# Altium schematic sheet Sheet2.SchDoc
size 420 x 297 mm; CheckedBy: Ravindu Tennakoon; DrawnBy: Senuda Ratnayake; SheetNumber: 1; SheetTotal: 1
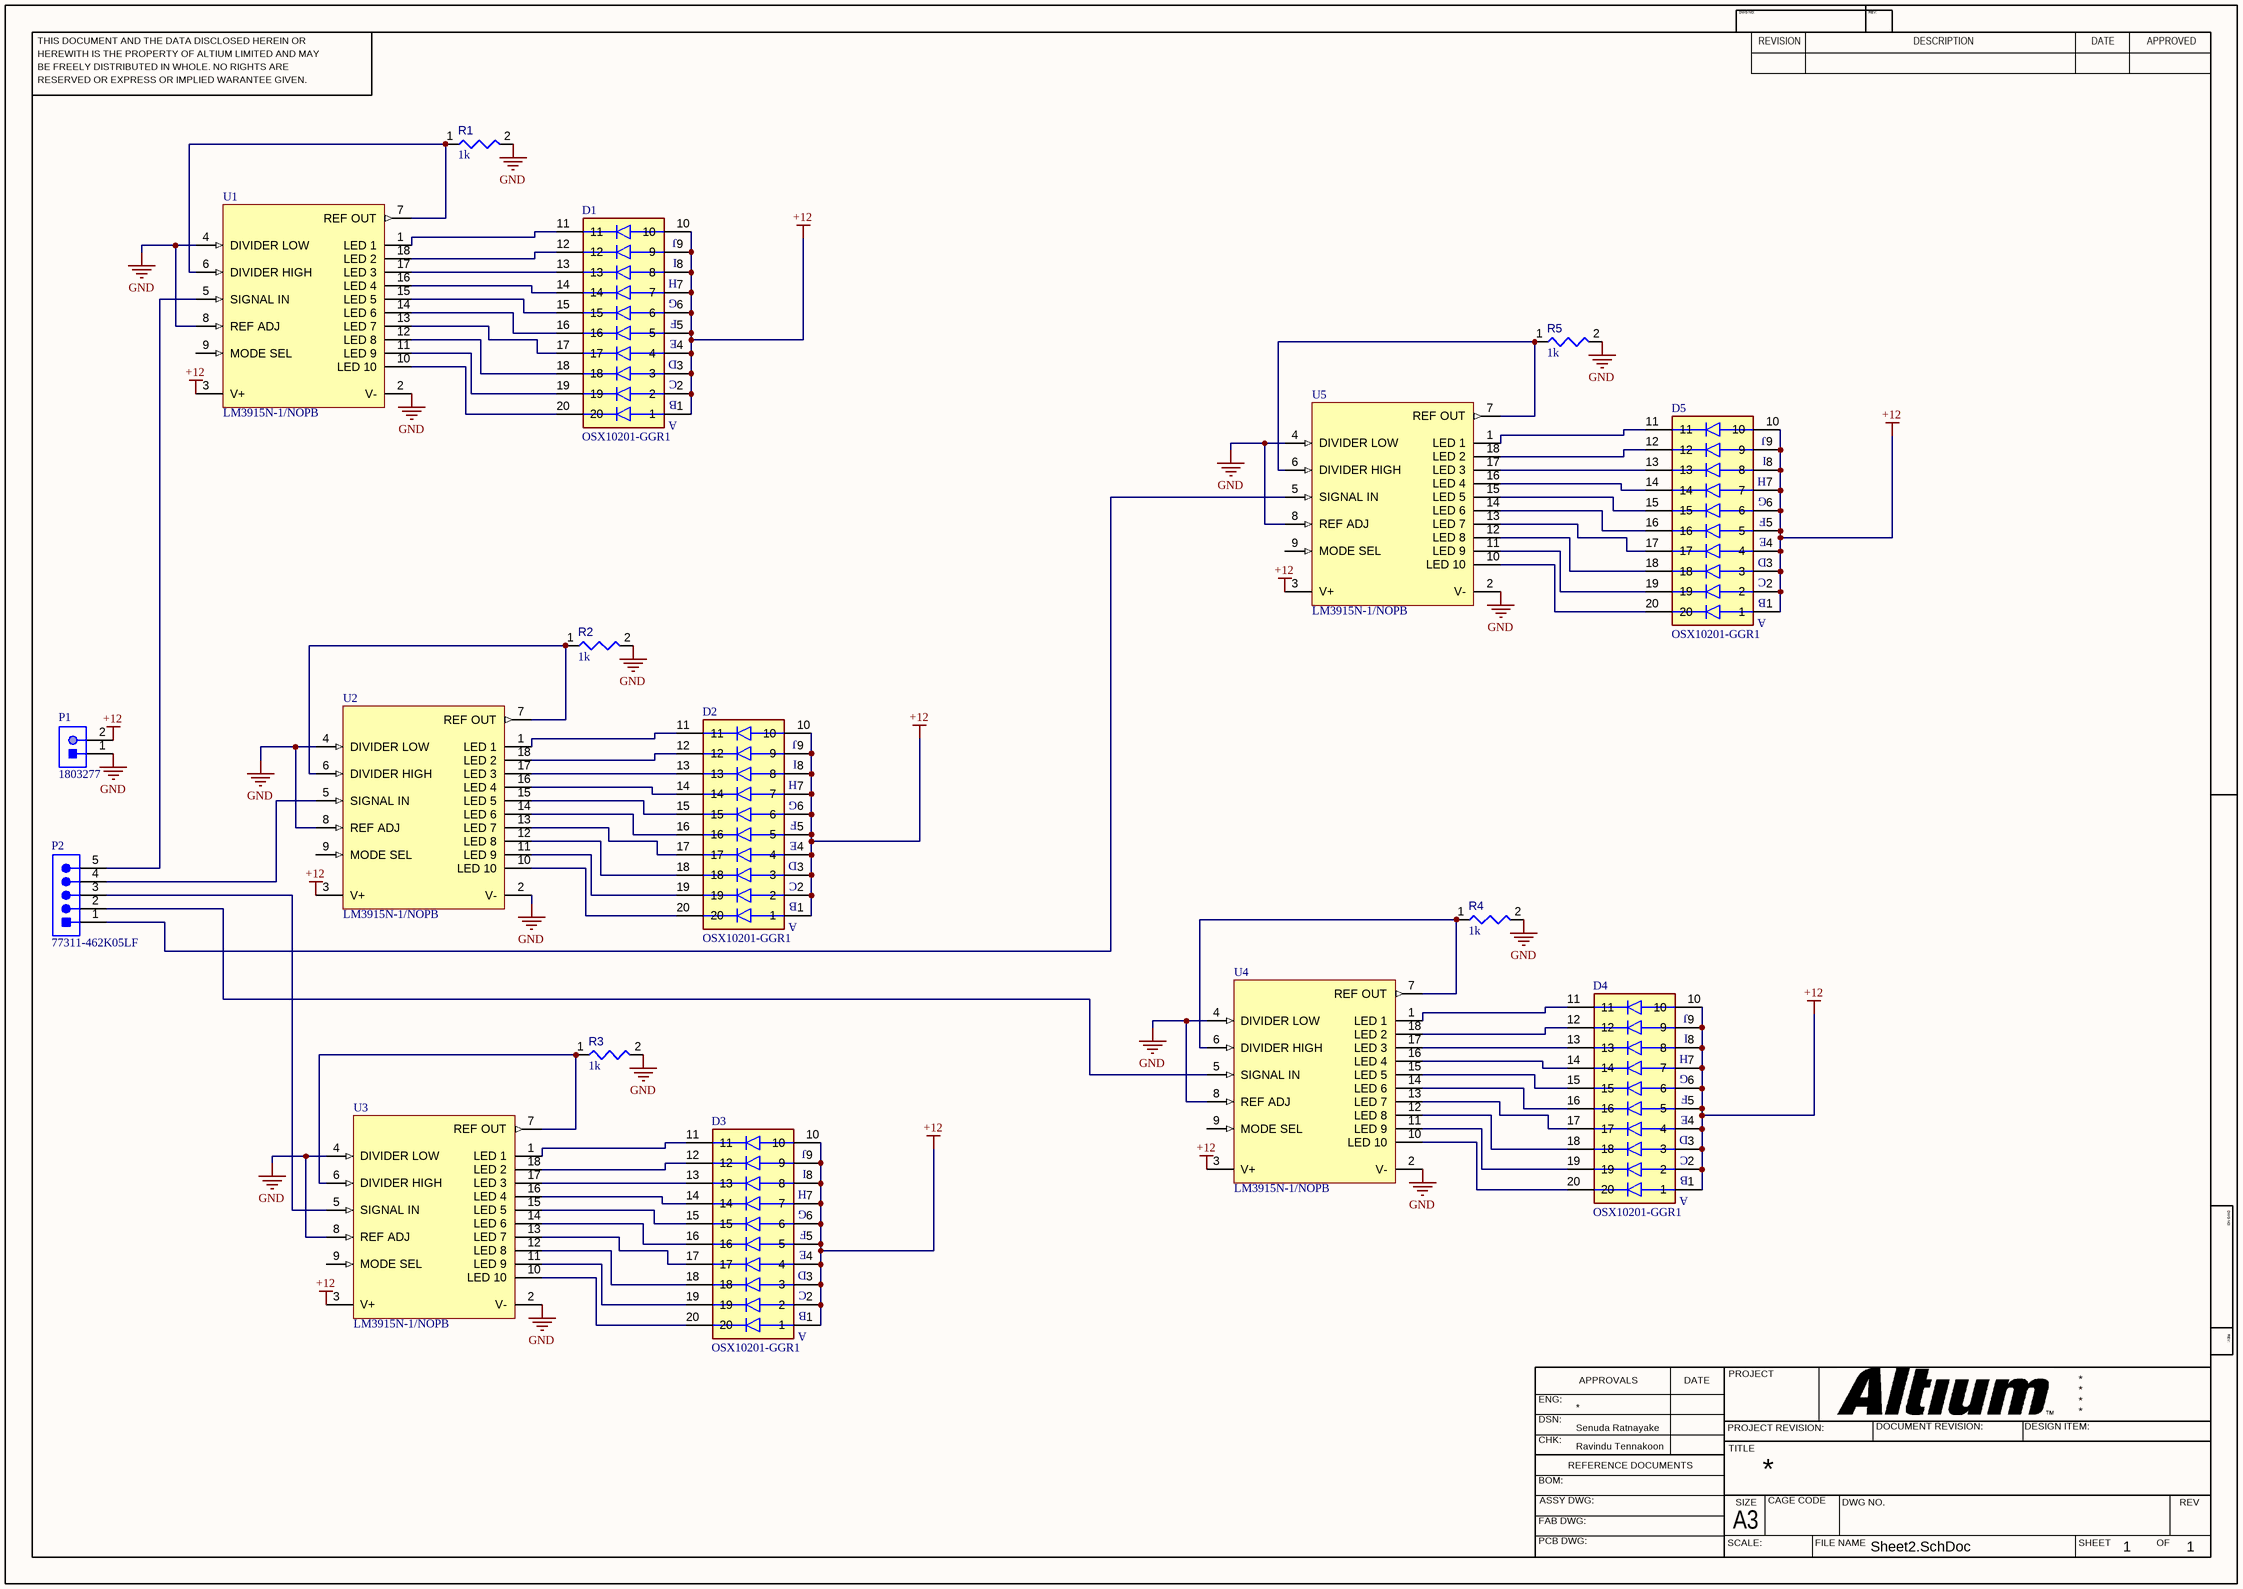
[diagram p0: Sheet2.SchDoc]

## Parts
D1  OSX10201-GGR1  [DIP760W45P254L2550H790Q20]
D2  OSX10201-GGR1  [DIP760W45P254L2550H790Q20]
D3  OSX10201-GGR1  [DIP760W45P254L2550H790Q20]
D4  OSX10201-GGR1  [DIP760W45P254L2550H790Q20]
D5  OSX10201-GGR1  [DIP760W45P254L2550H790Q20]
P1  1803277  [PHOE-1803277_V]
P2  77311-462K05LF  [FCI-77311-5_V]
R1  value 1k  [RESA60-630X240]  (hidden comment: MFR-25FBF52-1K)
R2  value 1k  [RESA60-630X240]  (hidden comment: MFR-25FBF52-1K)
R3  value 1k  [RESA60-630X240]  (hidden comment: MFR-25FBF52-1K)
R4  value 1k  [RESA60-630X240]  (hidden comment: MFR-25FBF52-1K)
R5  value 1k  [RESA60-630X240]  (hidden comment: MFR-25FBF52-1K)
U1  LM3915N-1/NOPB  [NFK0018A]
U2  LM3915N-1/NOPB  [NFK0018A]
U3  LM3915N-1/NOPB  [NFK0018A]
U4  LM3915N-1/NOPB  [NFK0018A]
U5  LM3915N-1/NOPB  [NFK0018A]

## Nets
+12: D1.1 D1.2 D1.3 D1.4 D1.5 D1.6 D1.7 D1.8 D1.9 D1.10 D2.1 D2.2 D2.3 D2.4 D2.5 D2.6 D2.7 D2.8 D2.9 D2.10 D3.1 D3.2 D3.3 D3.4 D3.5 D3.6 D3.7 D3.8 D3.9 D3.10 D4.1 D4.2 D4.3 D4.4 D4.5 D4.6 D4.7 D4.8 D4.9 D4.10 D5.1 D5.2 D5.3 D5.4 D5.5 D5.6 D5.7 D5.8 D5.9 D5.10 P1.2 U1.3(V+) U2.3(V+) U3.3(V+) U4.3(V+) U5.3(V+)
GND: P1.1 R1.2 R2.2 R3.2 R4.2 R5.2 U1.2(V-) U1.4(DIVIDER_LOW) U1.8(REF_ADJ) U2.2(V-) U2.4(DIVIDER_LOW) U2.8(REF_ADJ) U3.2(V-) U3.4(DIVIDER_LOW) U3.8(REF_ADJ) U4.2(V-) U4.4(DIVIDER_LOW) U4.8(REF_ADJ) U5.2(V-) U5.4(DIVIDER_LOW) U5.8(REF_ADJ)
NetD1_11: D1.11 U1.1(LED_1)
NetD1_12: D1.12 U1.18(LED_2)
NetD1_13: D1.13 U1.17(LED_3)
NetD1_14: D1.14 U1.16(LED_4)
NetD1_15: D1.15 U1.15(LED_5)
NetD1_16: D1.16 U1.14(LED_6)
NetD1_17: D1.17 U1.13(LED_7)
NetD1_18: D1.18 U1.12(LED_8)
NetD1_19: D1.19 U1.11(LED_9)
NetD1_20: D1.20 U1.10(LED_10)
NetD2_11: D2.11 U2.1(LED_1)
NetD2_12: D2.12 U2.18(LED_2)
NetD2_13: D2.13 U2.17(LED_3)
NetD2_14: D2.14 U2.16(LED_4)
NetD2_15: D2.15 U2.15(LED_5)
NetD2_16: D2.16 U2.14(LED_6)
NetD2_17: D2.17 U2.13(LED_7)
NetD2_18: D2.18 U2.12(LED_8)
NetD2_19: D2.19 U2.11(LED_9)
NetD2_20: D2.20 U2.10(LED_10)
NetD3_11: D3.11 U3.1(LED_1)
NetD3_12: D3.12 U3.18(LED_2)
NetD3_13: D3.13 U3.17(LED_3)
NetD3_14: D3.14 U3.16(LED_4)
NetD3_15: D3.15 U3.15(LED_5)
NetD3_16: D3.16 U3.14(LED_6)
NetD3_17: D3.17 U3.13(LED_7)
NetD3_18: D3.18 U3.12(LED_8)
NetD3_19: D3.19 U3.11(LED_9)
NetD3_20: D3.20 U3.10(LED_10)
NetD4_11: D4.11 U4.1(LED_1)
NetD4_12: D4.12 U4.18(LED_2)
NetD4_13: D4.13 U4.17(LED_3)
NetD4_14: D4.14 U4.16(LED_4)
NetD4_15: D4.15 U4.15(LED_5)
NetD4_16: D4.16 U4.14(LED_6)
NetD4_17: D4.17 U4.13(LED_7)
NetD4_18: D4.18 U4.12(LED_8)
NetD4_19: D4.19 U4.11(LED_9)
NetD4_20: D4.20 U4.10(LED_10)
NetD5_11: D5.11 U5.1(LED_1)
NetD5_12: D5.12 U5.18(LED_2)
NetD5_13: D5.13 U5.17(LED_3)
NetD5_14: D5.14 U5.16(LED_4)
NetD5_15: D5.15 U5.15(LED_5)
NetD5_16: D5.16 U5.14(LED_6)
NetD5_17: D5.17 U5.13(LED_7)
NetD5_18: D5.18 U5.12(LED_8)
NetD5_19: D5.19 U5.11(LED_9)
NetD5_20: D5.20 U5.10(LED_10)
NetP2_1: P2.1(DTR) U5.5(SIGNAL_IN)
NetP2_2: P2.2(RXI) U4.5(SIGNAL_IN)
NetP2_3: P2.3(TXO) U3.5(SIGNAL_IN)
NetP2_4: P2.4(VCC) U2.5(SIGNAL_IN)
NetP2_5: P2.5(CTS) U1.5(SIGNAL_IN)
NetR1_1: R1.1 U1.6(DIVIDER_HIGH) U1.7(REF_OUT)
NetR2_1: R2.1 U2.6(DIVIDER_HIGH) U2.7(REF_OUT)
NetR3_1: R3.1 U3.6(DIVIDER_HIGH) U3.7(REF_OUT)
NetR4_1: R4.1 U4.6(DIVIDER_HIGH) U4.7(REF_OUT)
NetR5_1: R5.1 U5.6(DIVIDER_HIGH) U5.7(REF_OUT)

Not connected (* = marked no-connect by the designer): U1 9(MODE_SEL); U2 9(MODE_SEL); U3 9(MODE_SEL); U4 9(MODE_SEL); U5 9(MODE_SEL)

## Notes on the sheet
- THIS DOCUMENT AND THE DATA DISCLOSED HEREIN OR
- HEREWITH IS THE PROPERTY OF ALTIUM LIMITED AND MAY
- DWG NO:
- REVISION
- REV:
- DESCRIPTION
- DATE
- APPROVED
- BE FREELY DISTRIBUTED IN WHOLE. NO RIGHTS ARE
- RESERVED OR EXPRESS OR IMPLIED WARANTEE GIVEN.
- ENG:
- APPROVALS
- PROJECT
- DSN:
- CHK:
- REFERENCE DOCUMENTS
- PROJECT REVISION:
- TITLE
- DOCUMENT REVISION:
- DESIGN ITEM:
- BOM:
- FAB DWG:
- PCB DWG:
- ASSY DWG:
- SCALE:
- A3
- SIZE
- CAGE CODE
- FILE NAME
- DWG NO.
- SHEET
- OF
- REV
- (in symbol OSX10201-GGR1) J; I; H; G; F; E; D; C; B; A

## Library data of the parts
D1-D5 = OSX10201-GGR1: Display: LED; bargraph; green (7x) / red (3x); 25.5x10.2x7.9mm; MF: OptoSupply; SnapEDA_Link: https://www.snapeda.com/parts/OSX10201-GGR1/OptoSupply/view-part/?ref=snap; Package: None; Value: *; MP: OSX10201-GGR1; Check_prices: https://www.snapeda.com/parts/OSX10201-GGR1/OptoSupply/view-part/?ref=eda
P1 = CMP-002-00014-2: Male Header, Pitch 3.81 mm, 1 x 2 Position, Height 7.25 mm, Tail Length 3.4 mm, RoHS, Bulk; Manufacturer: Phoenix Contact; Voltage Rating: 160V; Current Rating: 8A; Rows: 1; Mounting Technology: TH; Contact Plating: Tin; Case/Package: 1803277; Gender: Male; Diameter: 7.25mm; Datasheet Version: Feb-14; Colour: Green; Pins: 2; Lead Pitch: 0.15inch; Connector Type: Header; Package Quantity: 50; Max Current Rating: 8A; Manufacturer URL: http://www.phoenixcontact.com/; Packaging: Bulk; RoHS Compliant: True; Datasheet URL: https://datasheet.ciiva.com/16096/1803277-16096845.pdf; Package Reference: 1803277; Package Description: Male Header, Pitch 3.81 mm, 1 x 2 Position, Height 7.25 mm, Tail Length 3.4 mm
P2 = CMP-002-00021-2: Male Header, Pitch 2.54 mm, 1 x 5 Position, Height 16.24 mm, Tail Length 3.05 mm, -65 to 125 degC, RoHS, Tape and Reel; Manufacturer: FCI Electronics; Connector Type: Header; Manufacturer URL: http://portal.fciconnect.com/; Datasheet URL: http://portal.fciconnect.com/Comergent//fci/drawing/77311.pdf; Gender: Male; Case/Package: 77311-5; Package Reference: 77311-5; Datasheet Version: Rev. CK, 07/2016; Package Description: Male Header, Pitch 2.54 mm, 1 x 5 Position, Height 16.24 mm, Tail Length 3.05 mm; RoHS Compliant: Unknown; Mounting Technology: TH
R1-R5 = CMP-009-00048-4: Axial Resistor, 1 KOhm, +/- 1%, 250 mW, -55 to 155 degC, 2-Pin THD, RoHS, Bulk; Manufacturer: Yageo; Voltage Rating: 250V; Power: 250mW; Min Operating Temperature: -55°C; Max Operating Temperature: 155°C; Tolerance: 1%; Package Reference: MFR-25; Composition: CarbonFilm; Mounting Technology: TH; Packaging: Bulk; Case/Package: Axial; Datasheet URL: http://www.yageo.com/documents/recent/Yageo%20LR_MFR_2013.pdf; Package Quantity: 200; Manufacturer URL: http://www.yageo.com/; Package Description: 2-Pin Axial Lead, Dia 2.4 mm, Body Length 6.3 mm; Datasheet Version: Apr-13; RoHS Compliant: True
U1-U5 = CMP-0058-00004-3: Dot/Bar Display Driver, 18-pin MDIP, Pb-Free; Manufacturer: Texas Instruments; CompType: Audio IC; PowerWise: N; PackageTopMarking: NSUZXYYTTE#*LM3915N-1; PinCount: 18; ComponentLink1Description: Datasheet URL; PackageReference: NFK0018A; RoHS: Y; ComponentLink1URL: http://www.ti.com/general/docs/lit/getliterature.tsp?genericPartNumber=LM3915&fileType=pdf; PackageDescription: MDIP, .900 x .250 x .155in, 18 Lead, .100in Pitch; Code_JEDEC: MS-001-AC